# Altium project Antenna_Side.PrjPcb
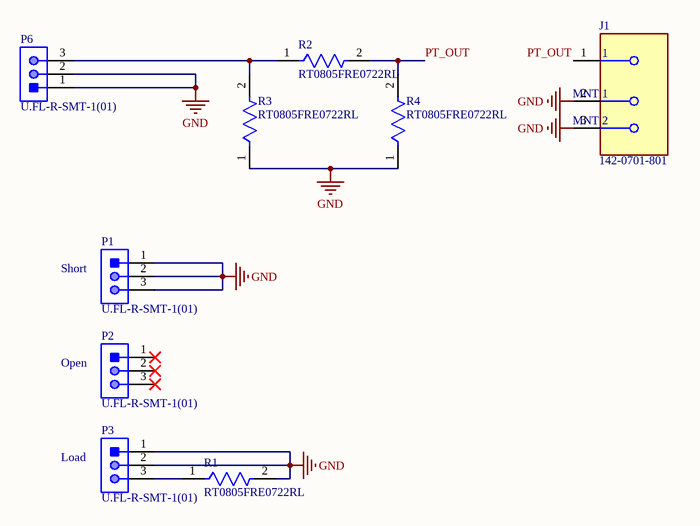
[diagram p0: AntennaSide.SchDoc]
1 sheet, 9 parts. Net scope: global (net labels, ports and power ports of the same name join across sheets).
Board file: AntennaSide.PcbDoc

## Sheet AntennaSide.SchDoc
size A; SheetNumber: 1; SheetTotal: 1

### Parts
J1  142-0701-801  [FP-142-0701-801-MFG]
P1  U.FL-R-SMT-1(01)  [HRS-U.FL-R-SMT-3_V]
P2  U.FL-R-SMT-1(01)  [HRS-U.FL-R-SMT-3_V]
P3  U.FL-R-SMT-1(01)  [HRS-U.FL-R-SMT-3_V]
P6  U.FL-R-SMT-1(01)  [HRS-U.FL-R-SMT-3_V]
R1  RT0805FRE0722RL  [FP-RT0805-MFG]
R2  RT0805FRE0722RL  [FP-RT0805-MFG]
R3  RT0805FRE0722RL  [FP-RT0805-MFG]
R4  RT0805FRE0722RL  [FP-RT0805-MFG]

### Nets
GND: J1.2(MNT_1) J1.3(MNT_2) P1.1 P1.2 P1.3 P3.1 P3.2 P6.1 P6.2 R1.2 R3.1 R4.1
PT_OUT: J1.1 R2.2 R4.2
NetP3_3: P3.3 R1.1
NetP6_3: P6.3 R2.1 R3.2

Not connected (* = marked no-connect by the designer): P2 1* 2* 3*

### Notes on the sheet
- (near P1) Short
- (near P2) Open
- (near P3) Load

### Library data of the parts
J1 = CMP-09588-000002-1: CONN SMA JACK STR 50OHM EDGE MNT; Frequency: 18GHz; Operating Frequency: 0 to 18 GHz; Body Material: Brass; Impedance: 50R; Voltage Rating: 335V; Gender: Female; Body Plating: Gold; Orientation: Straight; Length: 0.44inch; Max Operating Temperature: 165°C; Package Quantity: 5; Packaging: Bulk; Series: SMA; Contact Material: Copper; Min Operating Temperature: -65°C; Depth: 25.58mm; RoHS Compliant: Yes; Case/Package: SMA; Max Frequency: 18GHz; Radiation Hardening: No; Contact Plating: Gold; Mount: Edge; Connector Type: SMA; Fastening Type: Threaded; Termination: Solder
P1-P3 P6 = CMP-2000-05153-1: Ultra Small Coaxial Connector, 6 GHz, -40 to 90 degC, 3-Pin SMD, RoHS, Bulk; Manufacturer: Hirose Electric; Connector Style: U.FL; Impedance: 50Ohm; Dielectric Material: LiquidCrystalPolymer(LCP); Minimum Quantity: UltraMiniatureCoaxial; Online Catalog: U.FLSeries; Featured Product: HiroseU.FLSeries; Frequency - Max: 6GHz; Other Names: H122041 / U.FL-R-SMT-1(01)-ND; Contact Termination: Solder; Body Material: PhosphorBronze; Connector Type: Jack,MalePin; Body Finish: Silver; Center Contact Plating: Gold; Manufacturer URL: https://www.hirose.com; Family: CoaxialConnectors(RF); Fastening Type: Snap-On; Unit PriceUSD: U.FL; Series: U.FL; Package Reference: U.FL-R-SMT; Packaging: Bulk; Standard Package: 100; Mounting Type: SurfaceMount; Quantity Available: Bulk; Housing Color: Silver; Package Description: 3-Pin Surface Mount Device, Body 2.6 x 2.6 mm; Category: Connectors,Interconnects; Operating Temperature: -40degC~90degC; Center Contact Material: PhosphorBronze; Dynamic Catalog: U.FLSeries; Datasheet URL: https://datasheet.ciiva.com/26945/getdatasheetpartid-475239-26945414.pdf; Datasheet Version: Feb-09; Shield Termination: Solder
R1-R4 = CMP-03412-009509-1: RES SMD 22 OHM 1% 1/8W 0805; Manufacturer: Yageo; Value: 22Ω; Power Rating: 0.125W; Tolerance: 0.0001; Voltage Rating: 150V; Temperature Coefficient: 50 ppm/°C; Height: 0.6mm; ComponentLink2Description: Datasheet; Composition: Thin Film; Octopart: https://octopart.com/rt0805fre0722rl-yageo-39984181; Device Class L1: Passive Components; RoHS: TRUE; Temperature Range Low: -55°C; Temperature Range High: +155°C; Automotive: No; Lead Free: Yes; Resistance: 22Ω; Device Class L2: Resistors; Series: RT; Category: Res; Manufacturer Part Number: RT0805FRE0722RL; ComponentLink2URL: http://www.yageo.com/documents/recent/PYu-RT_1-to-0.01_RoHS_L_9.pdf; Footprint Url: http://www.yageo.com/exep/pages/download/literatures/PYu-R_Mount_10.pdf; Digikey Description: RES SMD 22 OHM 1% 1/8W 0805; Package: RT0805; Device Class L3: Chip SMD Resistors; Ipc Land Pattern Name: RESC200125X50; Temperature: -55°C to +155°C; Mouser Description: Thin Film Resistors - SMD 1/8W 22 ohm 1% 50ppm